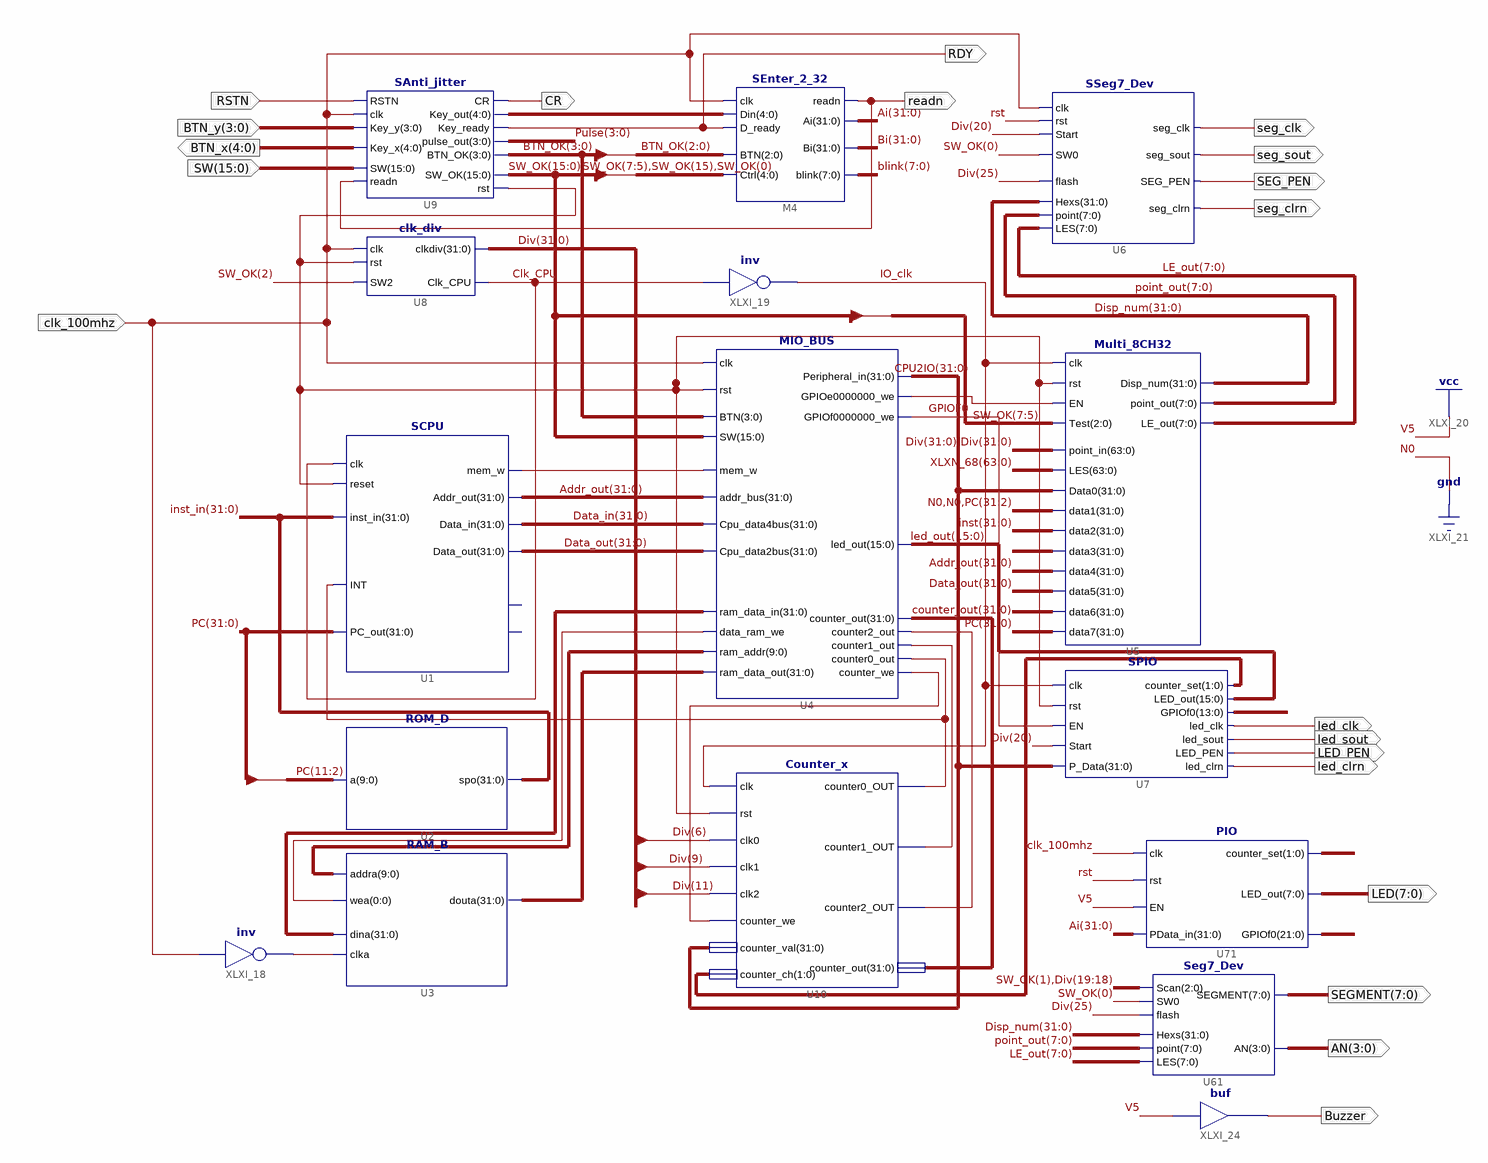
[diagram p0: schematic sheet 1]
// Xilinx ISE schematic topMod.sch (kintex7) as structural Verilog: 16 symbols, 20 ports
module topMod (
  input  RSTN,
  input  [3:0] BTN_y,
  input  [15:0] SW,
  input  clk_100mhz,
  output [4:0] BTN_x,
  output CR,
  output RDY,
  output seg_clk,
  output seg_sout,
  output SEG_PEN,
  output seg_clrn,
  output readn,
  output led_clk,
  output led_sout,
  output LED_PEN,
  output led_clrn,
  output [7:0] LED,
  output [7:0] SEGMENT,
  output [3:0] AN,
  output Buzzer
);

  wire Clk_CPU, GPIOF0, IO_clk, rst, XLXN_33, XLXN_36, XLXN_64, XLXN_81, XLXN_82, XLXN_84, XLXN_91, XLXN_112;
  wire [0:0] XLXN_124;
  wire [1:0] XLXN_86, XLXN_132;
  wire [3:0] BTN_OK, Pulse;
  wire [4:0] XLXN_8;
  wire [7:0] blink, LE_out, point_out;
  wire [9:0] XLXN_122;
  wire [13:0] XLXN_76;
  wire [15:0] led_out, SW_OK;
  wire [21:0] XLXN_134;
  wire [31:0] Addr_out, Ai, Bi, counter_out, CPU2IO, Data_in, Data_out, Disp_num, Div, inst, inst_in, PC,
       XLXN_120, XLXN_125;
  wire [63:0] XLXN_68;

  SAnti_jitter U9 (
    .SW(SW), .readn(readn), .Key_y(BTN_y), .Key_x(BTN_x), .RSTN(RSTN), .clk(clk_100mhz), .Key_out(XLXN_8),
    .Key_ready(RDY), .CR(CR), .rst(XLXN_33), .SW_OK(SW_OK), .pulse_out(Pulse), .BTN_OK(BTN_OK));
  clk_div U8 (.rst(XLXN_33), .clk(clk_100mhz), .SW2(SW_OK[2]), .clkdiv(Div), .Clk_CPU(Clk_CPU));
  SCPU U1 (
    .clk(Clk_CPU), .reset(XLXN_33), .inst_in(inst_in), .INT(XLXN_81), .Addr_out(Addr_out), .mem_w(XLXN_112),
    .Data_out(Data_out), .Data_in(Data_in), .PC_out(PC));  // open: CPU_MIO, MIO_ready
  ROM_D U2 (.a(PC[11:2]), .spo(inst_in));
  RAM_B U3 (.addra(XLXN_122), .clka(XLXN_36), .wea(XLXN_124[0]), .dina(XLXN_125), .douta(XLXN_120));
  Counter_x U10 (
    .clk(IO_clk), .rst(XLXN_33), .clk0(Div[6]), .clk1(Div[9]), .clk2(Div[11]), .counter_we(XLXN_64),
    .counter_val(CPU2IO), .counter_ch(XLXN_86), .counter0_OUT(XLXN_81), .counter1_OUT(XLXN_82),
    .counter2_OUT(XLXN_84), .counter_out(counter_out));
  SSeg7_Dev U6 (
    .LES(LE_out), .SEG_PEN(SEG_PEN), .seg_sout(seg_sout), .seg_clrn(seg_clrn), .point(point_out),
    .Hexs(Disp_num), .SW0(SW_OK[0]), .flash(Div[25]), .seg_clk(seg_clk), .clk(clk_100mhz), .rst(rst),
    .Start(Div[20]));
  MIO_BUS U4 (
    .rst(XLXN_33), .clk(clk_100mhz), .mem_w(XLXN_112), .addr_bus(Addr_out), .Cpu_data4bus(Data_in),
    .Cpu_data2bus(Data_out), .ram_data_out(XLXN_120), .ram_addr(XLXN_122), .data_ram_we(XLXN_124[0]),
    .ram_data_in(XLXN_125), .counter_out(counter_out), .counter2_out(XLXN_84), .counter1_out(XLXN_82),
    .counter0_out(XLXN_81), .counter_we(XLXN_64), .BTN(BTN_OK), .SW(SW_OK), .led_out(led_out),
    .Peripheral_in(CPU2IO), .GPIOe0000000_we(XLXN_91), .GPIOf0000000_we(GPIOF0));
  Multi_8CH32 U5 (
    .Test(SW_OK[7:5]), .point_in({Div, Div}), .EN(XLXN_91), .clk(IO_clk), .rst(XLXN_33), .LES(XLXN_68),
    .Data0(CPU2IO), .data1({2'b00, PC[31:2]}), .data2(inst), .data3(counter_out), .data4(Addr_out),
    .data5(Data_out), .data6(Data_in), .data7(PC), .point_out(point_out), .LE_out(LE_out), .Disp_num(Disp_num));
  SPIO U7 (
    .clk(IO_clk), .P_Data(CPU2IO), .rst(XLXN_33), .EN(GPIOF0), .Start(Div[20]), .led_clk(led_clk),
    .GPIOf0(XLXN_76), .LED_out(led_out), .counter_set(XLXN_86), .led_clrn(led_clrn), .LED_PEN(LED_PEN),
    .led_sout(led_sout));
  Seg7_Dev U61 (
    .LES(LE_out), .Scan({SW_OK[1], Div[19:18]}), .SEGMENT(SEGMENT), .AN(AN), .point(point_out),
    .flash(Div[25]), .SW0(SW_OK[0]), .Hexs(Disp_num));
  SEnter_2_32 M4 (
    .readn(readn), .Ai(Ai), .Bi(Bi), .blink(blink), .Din(XLXN_8), .D_ready(RDY), .clk(clk_100mhz),
    .Ctrl({SW_OK[7:5], SW_OK[15], SW_OK[0]}), .BTN(BTN_OK[2:0]));
  not XLXI_18 (XLXN_36, clk_100mhz);
  not XLXI_19 (IO_clk, Clk_CPU);
  PIO U71 (
    .clk(clk_100mhz), .rst(rst), .EN(1'b1), .PData_in(Ai), .GPIOf0(XLXN_134), .LED_out(LED),
    .counter_set(XLXN_132));
  buf XLXI_24 (Buzzer, 1'b1);
endmodule
